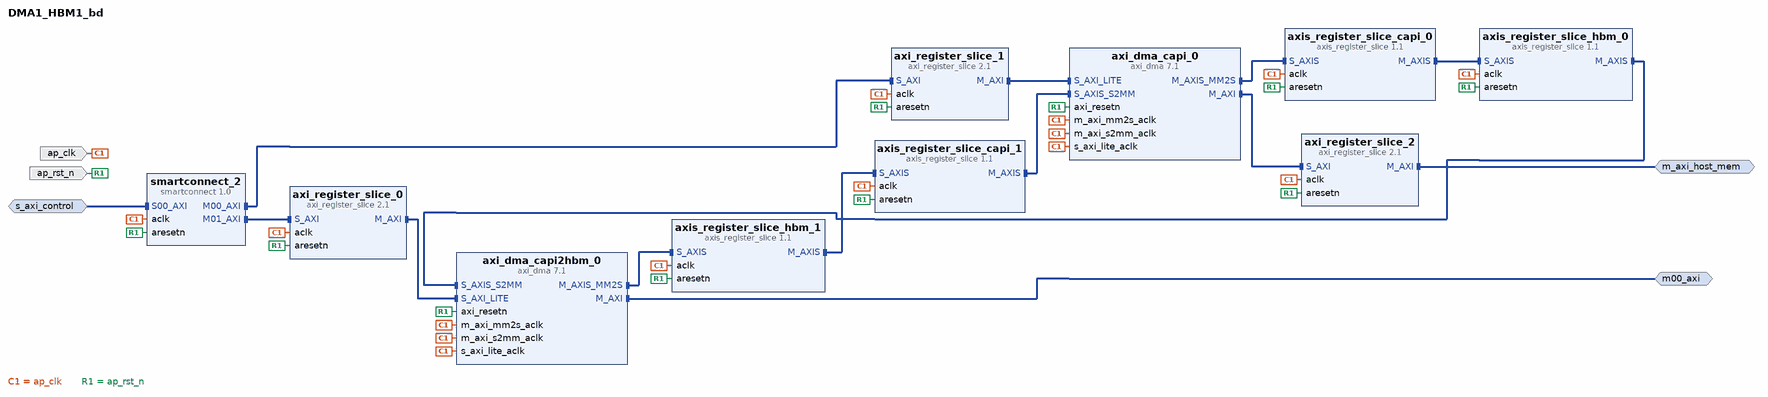
[diagram p0: block diagram of the top level]
# Vivado block design DMA1_HBM1_bd, xcvu37p-fsvh2892-2-e-es1, Vivado 2019.1
create_bd_design DMA1_HBM1_bd

create_bd_intf_port -mode Master -vlnv xilinx.com:interface:aximm_rtl:1.0 m00_axi
set_property -dict [list \
  CONFIG.ADDR_WIDTH 64 \
  CONFIG.DATA_WIDTH 256 \
  CONFIG.FREQ_HZ 250000000 \
  CONFIG.HAS_BRESP 0 \
  CONFIG.HAS_BURST 0 \
  CONFIG.HAS_CACHE 0 \
  CONFIG.HAS_LOCK 0 \
  CONFIG.HAS_PROT 0 \
  CONFIG.HAS_QOS 0 \
  CONFIG.HAS_REGION 0 \
  CONFIG.HAS_WSTRB 1 \
  CONFIG.NUM_READ_OUTSTANDING 1 \
  CONFIG.NUM_WRITE_OUTSTANDING 1 \
  CONFIG.PROTOCOL AXI4 \
  CONFIG.READ_WRITE_MODE READ_WRITE \
] [get_bd_intf_ports m00_axi]
create_bd_intf_port -mode Slave -vlnv xilinx.com:interface:aximm_rtl:1.0 s_axi_control
set_property -dict [list \
  CONFIG.ADDR_WIDTH 32 \
  CONFIG.ARUSER_WIDTH 0 \
  CONFIG.AWUSER_WIDTH 0 \
  CONFIG.BUSER_WIDTH 0 \
  CONFIG.DATA_WIDTH 32 \
  CONFIG.FREQ_HZ 250000000 \
  CONFIG.HAS_BRESP 1 \
  CONFIG.HAS_BURST 0 \
  CONFIG.HAS_CACHE 0 \
  CONFIG.HAS_LOCK 0 \
  CONFIG.HAS_PROT 1 \
  CONFIG.HAS_QOS 0 \
  CONFIG.HAS_REGION 0 \
  CONFIG.HAS_RRESP 1 \
  CONFIG.HAS_WSTRB 1 \
  CONFIG.ID_WIDTH 0 \
  CONFIG.MAX_BURST_LENGTH 1 \
  CONFIG.NUM_READ_OUTSTANDING 1 \
  CONFIG.NUM_READ_THREADS 1 \
  CONFIG.NUM_WRITE_OUTSTANDING 1 \
  CONFIG.NUM_WRITE_THREADS 1 \
  CONFIG.PROTOCOL AXI4LITE \
  CONFIG.READ_WRITE_MODE READ_WRITE \
  CONFIG.RUSER_BITS_PER_BYTE 0 \
  CONFIG.RUSER_WIDTH 0 \
  CONFIG.SUPPORTS_NARROW_BURST 0 \
  CONFIG.WUSER_BITS_PER_BYTE 0 \
  CONFIG.WUSER_WIDTH 0 \
  CONFIG.master_id 0 \
] [get_bd_intf_ports s_axi_control]
create_bd_intf_port -mode Master -vlnv xilinx.com:interface:aximm_rtl:1.0 m_axi_host_mem
set_property -dict [list \
  CONFIG.ADDR_WIDTH 64 \
  CONFIG.DATA_WIDTH 1024 \
  CONFIG.FREQ_HZ 250000000 \
  CONFIG.PROTOCOL AXI4 \
] [get_bd_intf_ports m_axi_host_mem]
create_bd_port -dir I -type clk ap_clk
set_property -dict [list \
  CONFIG.ASSOCIATED_BUSIF m00_axi:m01_axi:s_axi_control:m02_axi:m03_axi:m04_axi:m05_axi:m06_axi:m07_axi:m08_axi:m09_axi:m10_axi:m11_axi:m12_axi:m13_axi:m14_axi:m15_axi:m_axi_host_mem \
  CONFIG.FREQ_HZ 250000000 \
] [get_bd_ports ap_clk]
create_bd_port -dir I -type rst ap_rst_n

create_bd_cell -type ip -vlnv xilinx.com:ip:axi_dma:7.1 axi_dma_capi_0
set_property -dict [list \
  CONFIG.c_addr_width 64 \
  CONFIG.c_include_s2mm 1 \
  CONFIG.c_include_sg 0 \
  CONFIG.c_m_axi_mm2s_data_width 1024 \
  CONFIG.c_m_axi_s2mm_data_width 1024 \
  CONFIG.c_m_axis_mm2s_tdata_width 256 \
  CONFIG.c_mm2s_burst_size 32 \
  CONFIG.c_s2mm_burst_size 32 \
  CONFIG.c_single_interface 1 \
] [get_bd_cells axi_dma_capi_0]
create_bd_cell -type ip -vlnv xilinx.com:ip:smartconnect:1.0 smartconnect_2
set_property -dict {CONFIG.NUM_MI 2 CONFIG.NUM_SI 1} [get_bd_cells smartconnect_2]
create_bd_cell -type ip -vlnv xilinx.com:ip:axi_dma:7.1 axi_dma_capi2hbm_0
set_property -dict [list \
  CONFIG.c_addr_width 64 \
  CONFIG.c_include_sg 0 \
  CONFIG.c_m_axi_mm2s_data_width 256 \
  CONFIG.c_m_axi_s2mm_data_width 256 \
  CONFIG.c_m_axis_mm2s_tdata_width 256 \
  CONFIG.c_mm2s_burst_size 32 \
  CONFIG.c_s2mm_burst_size 32 \
  CONFIG.c_single_interface 1 \
] [get_bd_cells axi_dma_capi2hbm_0]
create_bd_cell -type ip -vlnv xilinx.com:ip:axis_register_slice:1.1 axis_register_slice_capi_0
set_property -dict [list \
  CONFIG.NUM_SLR_CROSSINGS 1 \
  CONFIG.PIPELINES_MASTER 2 \
  CONFIG.PIPELINES_SLAVE 2 \
  CONFIG.REG_CONFIG 15 \
] [get_bd_cells axis_register_slice_capi_0]
create_bd_cell -type ip -vlnv xilinx.com:ip:axis_register_slice:1.1 axis_register_slice_hbm_1
set_property -dict [list \
  CONFIG.NUM_SLR_CROSSINGS 1 \
  CONFIG.PIPELINES_MASTER 2 \
  CONFIG.PIPELINES_SLAVE 2 \
  CONFIG.REG_CONFIG 15 \
] [get_bd_cells axis_register_slice_hbm_1]
create_bd_cell -type ip -vlnv xilinx.com:ip:axi_register_slice:2.1 axi_register_slice_0
set_property -dict [list \
  CONFIG.REG_AR 10 \
  CONFIG.REG_AW 10 \
  CONFIG.REG_B 10 \
  CONFIG.REG_R 10 \
  CONFIG.REG_W 10 \
] [get_bd_cells axi_register_slice_0]
create_bd_cell -type ip -vlnv xilinx.com:ip:axi_register_slice:2.1 axi_register_slice_1
set_property -dict [list \
  CONFIG.REG_AR 10 \
  CONFIG.REG_AW 10 \
  CONFIG.REG_B 10 \
  CONFIG.REG_R 10 \
  CONFIG.REG_W 10 \
] [get_bd_cells axi_register_slice_1]
create_bd_cell -type ip -vlnv xilinx.com:ip:axis_register_slice:1.1 axis_register_slice_hbm_0
set_property -dict [list \
  CONFIG.NUM_SLR_CROSSINGS 1 \
  CONFIG.PIPELINES_MASTER 2 \
  CONFIG.PIPELINES_SLAVE 2 \
  CONFIG.REG_CONFIG 15 \
] [get_bd_cells axis_register_slice_hbm_0]
create_bd_cell -type ip -vlnv xilinx.com:ip:axis_register_slice:1.1 axis_register_slice_capi_1
set_property -dict [list \
  CONFIG.NUM_SLR_CROSSINGS 1 \
  CONFIG.PIPELINES_MASTER 2 \
  CONFIG.PIPELINES_SLAVE 2 \
  CONFIG.REG_CONFIG 15 \
] [get_bd_cells axis_register_slice_capi_1]
create_bd_cell -type ip -vlnv xilinx.com:ip:axi_register_slice:2.1 axi_register_slice_2
set_property -dict {CONFIG.REG_AR 1 CONFIG.REG_AW 1 CONFIG.REG_B 1} [get_bd_cells axi_register_slice_2]

# ---- connections ----

connect_bd_intf_net [get_bd_intf_ports m_axi_host_mem] [get_bd_intf_pins axi_register_slice_2/M_AXI]
connect_bd_intf_net -intf_net axis_register_slice_2_M_AXIS [get_bd_intf_pins axis_register_slice_hbm_0/M_AXIS] [get_bd_intf_pins axi_dma_capi2hbm_0/S_AXIS_S2MM]
connect_bd_intf_net [get_bd_intf_pins smartconnect_2/M01_AXI] [get_bd_intf_pins axi_register_slice_0/S_AXI]
connect_bd_intf_net -intf_net axis_register_slice_0_M_AXIS [get_bd_intf_pins axis_register_slice_capi_0/M_AXIS] [get_bd_intf_pins axis_register_slice_hbm_0/S_AXIS]
connect_bd_intf_net [get_bd_intf_pins smartconnect_2/M00_AXI] [get_bd_intf_pins axi_register_slice_1/S_AXI]
connect_bd_intf_net -intf_net axis_register_slice_3_M_AXIS [get_bd_intf_pins axis_register_slice_capi_1/M_AXIS] [get_bd_intf_pins axi_dma_capi_0/S_AXIS_S2MM]
connect_bd_intf_net -intf_net axis_register_slice_1_M_AXIS [get_bd_intf_pins axis_register_slice_hbm_1/M_AXIS] [get_bd_intf_pins axis_register_slice_capi_1/S_AXIS]
connect_bd_intf_net [get_bd_intf_ports s_axi_control] [get_bd_intf_pins smartconnect_2/S00_AXI]
connect_bd_intf_net [get_bd_intf_ports m00_axi] [get_bd_intf_pins axi_dma_capi2hbm_0/M_AXI]
connect_bd_intf_net [get_bd_intf_pins axi_dma_capi_0/M_AXIS_MM2S] [get_bd_intf_pins axis_register_slice_capi_0/S_AXIS]
connect_bd_intf_net [get_bd_intf_pins axi_register_slice_1/M_AXI] [get_bd_intf_pins axi_dma_capi_0/S_AXI_LITE]
connect_bd_intf_net [get_bd_intf_pins axi_register_slice_0/M_AXI] [get_bd_intf_pins axi_dma_capi2hbm_0/S_AXI_LITE]
connect_bd_intf_net [get_bd_intf_pins axi_dma_capi2hbm_0/M_AXIS_MM2S] [get_bd_intf_pins axis_register_slice_hbm_1/S_AXIS]
connect_bd_intf_net [get_bd_intf_pins axi_dma_capi_0/M_AXI] [get_bd_intf_pins axi_register_slice_2/S_AXI]
connect_bd_net [get_bd_ports ap_clk] \
  [get_bd_pins axi_dma_capi_0/s_axi_lite_aclk] [get_bd_pins axi_dma_capi_0/m_axi_mm2s_aclk] [get_bd_pins smartconnect_2/aclk] \
  [get_bd_pins axi_dma_capi2hbm_0/s_axi_lite_aclk] [get_bd_pins axi_dma_capi2hbm_0/m_axi_mm2s_aclk] \
  [get_bd_pins axi_dma_capi2hbm_0/m_axi_s2mm_aclk] [get_bd_pins axi_dma_capi_0/m_axi_s2mm_aclk] \
  [get_bd_pins axis_register_slice_capi_0/aclk] [get_bd_pins axis_register_slice_hbm_1/aclk] \
  [get_bd_pins axi_register_slice_1/aclk] [get_bd_pins axi_register_slice_0/aclk] \
  [get_bd_pins axis_register_slice_capi_1/aclk] [get_bd_pins axis_register_slice_hbm_0/aclk] \
  [get_bd_pins axi_register_slice_2/aclk]
connect_bd_net [get_bd_ports ap_rst_n] \
  [get_bd_pins axi_dma_capi_0/axi_resetn] [get_bd_pins smartconnect_2/aresetn] [get_bd_pins axi_dma_capi2hbm_0/axi_resetn] \
  [get_bd_pins axis_register_slice_capi_0/aresetn] [get_bd_pins axis_register_slice_hbm_1/aresetn] \
  [get_bd_pins axi_register_slice_1/aresetn] [get_bd_pins axi_register_slice_0/aresetn] \
  [get_bd_pins axis_register_slice_capi_1/aresetn] [get_bd_pins axis_register_slice_hbm_0/aresetn] \
  [get_bd_pins axi_register_slice_2/aresetn]

# ---- address map ----
assign_bd_address -offset 0x0000000064000000 -range 64K -target_address_space [get_bd_addr_spaces axi_dma_capi2hbm_0/Data] [get_bd_addr_segs m00_axi/Reg]
assign_bd_address -offset 0x0000000060000000 -range 64K -target_address_space [get_bd_addr_spaces axi_dma_capi_0/Data] [get_bd_addr_segs m_axi_host_mem/Reg]
assign_bd_address -offset 0x00000000 -range 4K -target_address_space [get_bd_addr_spaces s_axi_control] [get_bd_addr_segs axi_dma_capi2hbm_0/S_AXI_LITE/Reg]
assign_bd_address -offset 0x41E00000 -range 64K -target_address_space [get_bd_addr_spaces s_axi_control] [get_bd_addr_segs axi_dma_capi_0/S_AXI_LITE/Reg]

validate_bd_design
save_bd_design
